# EAGLE design Constant_Current_LED_Driver_v01 (EAGLE 6.4)
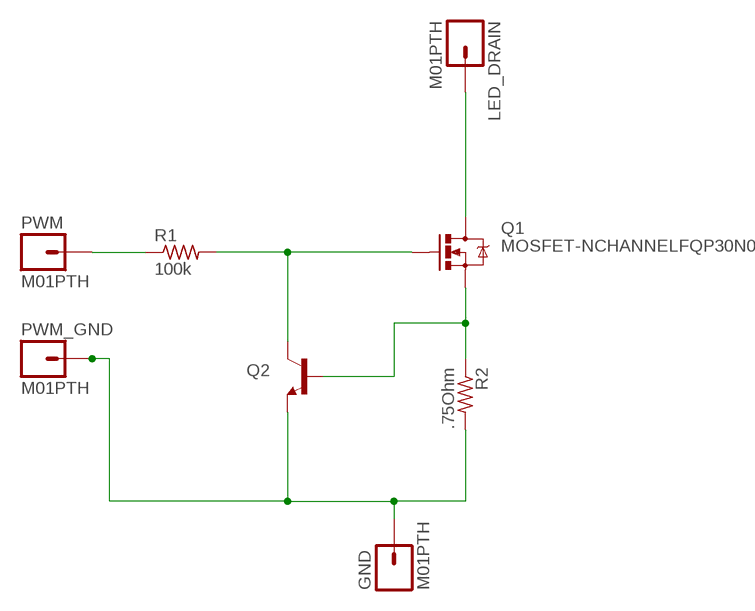
[diagram p0: schematic, sheet 1]

## Parts
GND  M01PTH  [1X01]
LED_DRAIN  M01PTH  [1X01]
PWM  M01PTH  [1X01]
PWM_GND  M01PTH  [1X01]
Q1  MOSFET-NCHANNELFQP30N06L  [TO220V]
Q2  TRANSISTOR_NPNTO92  [TO-92]
R1  100k  R-US_R0805W  [R0805W]
R2  .75Ohm  R-US_0204/5  [0204/5]

## Nets
FET_SOURCE: Q1.3(S) Q2.2(B) R2.1
GND: GND.1 PWM_GND.1 Q2.1(E) R2.2
LED_DRAIN: LED_DRAIN.1 Q1.2(D)
PWM_A: PWM.1 R1.1
PWM_B: Q1.1(G) Q2.3(C) R1.2

## Library data of the parts
GND LED_DRAIN PWM PWM_GND = SparkFun-Connectors:M01: Header 1 Standard 1-pin 0.1" header. Use with straight break away headers (SKU : PRT-00116), right angle break away headers (PRT-00553), swiss pins (PRT-00743), machine pins (PRT-00117), and female headers (PRT-00115).
Q1 = SparkFun-DiscreteSemi:MOSFET-NCHANNEL: Common NMOSFET Parts MFG P/N Store ID Prod ID FDD8780 TRANS-09984 SI7820DN TRANS-11055 FDS6630A IC-08089 2N7002PW TRANS-11151 FQP30N06L COM-10213 TRANS-10060 BSS123LT1G TRANS-08345 BSS138 TRANS-00830 BS170 2N7000; PROD_ID: TRANS-10060
Q2 = SparkFun-DiscreteSemi:TRANSISTOR_NPN: Generic NPN BJT MMBT2222A - TRANS-08049 (SOT-23, 1A 40V) MPSA42 - TRANS-09116 (SOT-23, 500mA 300V) MMBT5088LT1G - TRANS-11160 (SOT-23, 50 mA 30V)
R1 R2 = resistor:R-US_: RESISTOR, American symbol

## Board
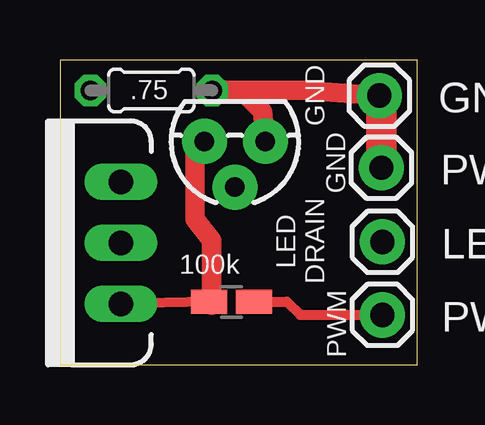
[diagram p1: board, top side]
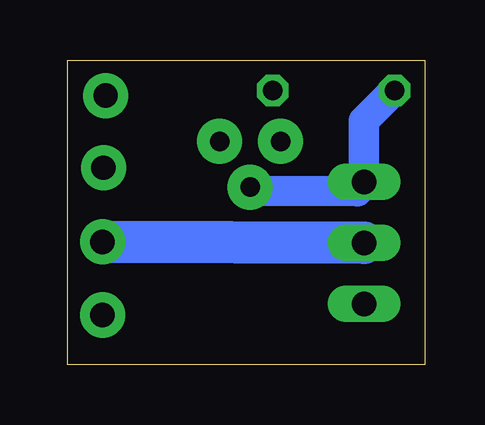
[diagram p2: board, bottom side, seen from below]

Size 14.91 x 12.69 mm. Coordinates in mm from the lower left corner, seen from the top.
Outline: 0,0 14.91,0 14.91,12.69 0,12.69 0,0
Copper layers (1*16): Top 0.035mm / dielectric 1.5mm / Bottom 0.035mm
Design rules "default": minimum track width 10mil, minimum drill 24mil, track to track 8mil, track to pad 8mil, pad to pad 8mil, via to via 8mil, smd to smd 8mil, copper to edge 40mil, drill to drill 8mil, minimum pad ring 10mil, minimum via ring 8mil, stop-mask expansion 4mil, vias tented up to drill 0mil, thermal gap 10mil

### Footprints (pad centres in the part's own frame; a part is rotated, then mirrored left to right if it is on the bottom)
1X01 = drill 1.016 pad 1.88: 1 0,0
TO220V = drill 1.016 long: 1 -2.54,0; 2 0,0; 3 2.54,0
TO-92 = drill 0.813 pad 1.88: 1 -1.27,0; 2 0,1.905; 3 1.27,0
R0805W = smd 1.5 x 1: 1 -0.94,0; 2 0.94,0
0204/5 = drill 0.813 octagon: 1 -2.54,0; 2 2.54,0

### Placement (x,y rotation side)
GND  13.32,11.21 0 top
LED_DRAIN  13.45,5.12 0 top
PWM  13.45,2.08 0 top
PWM_GND  13.41,8.21 0 top
Q1  2.54,5.08 90 top
Q2  7.3,9.31 180 top
R1  7.16,2.62 180 top
R2  3.81,11.43 0 top

### Tracks (layer width: path | path; a pad name or v marks a point on that pad's centre or on a via)
FET_SOURCE
  Bottom 0.406: R2.1 1.3,11.43 | 7.19,7.26 Q2.2 | Q1.3 2.73,7.58
  Bottom 1.27: Q1.3 2.54,10.16 R2.1 | 7.19,7.26 2.83,7.24 2.73,7.58
GND
  Top 0.406: R2.2 6.45,11.43
  Top 0.813: GND.1 10.16,11.43 R2.2 | 6.45,11.43 7.56,11.43 8.45,10.54 Q2.1
  Top 1.27: PWM_GND.1 13.41,11.13 GND.1
LED_DRAIN
  Bottom 1.778: Q1.2 LED_DRAIN.1
PWM_A
  Top 0.406: R1.1 9.47,2.63 10.02,2.08 PWM.1
PWM_B
  Top 0.406: 6.32,2.48 R1.2 Q1.1
  Top 0.813: 6.32,2.48 6.32,5.19 5.64,6.07 5.64,9.2 Q2.3

### Text on the board
_tsilk: GND | .75 | GND | LED / DRAIN | 100k | PWM